# Altium schematic sheet 01. Cover.SchDoc
size A3
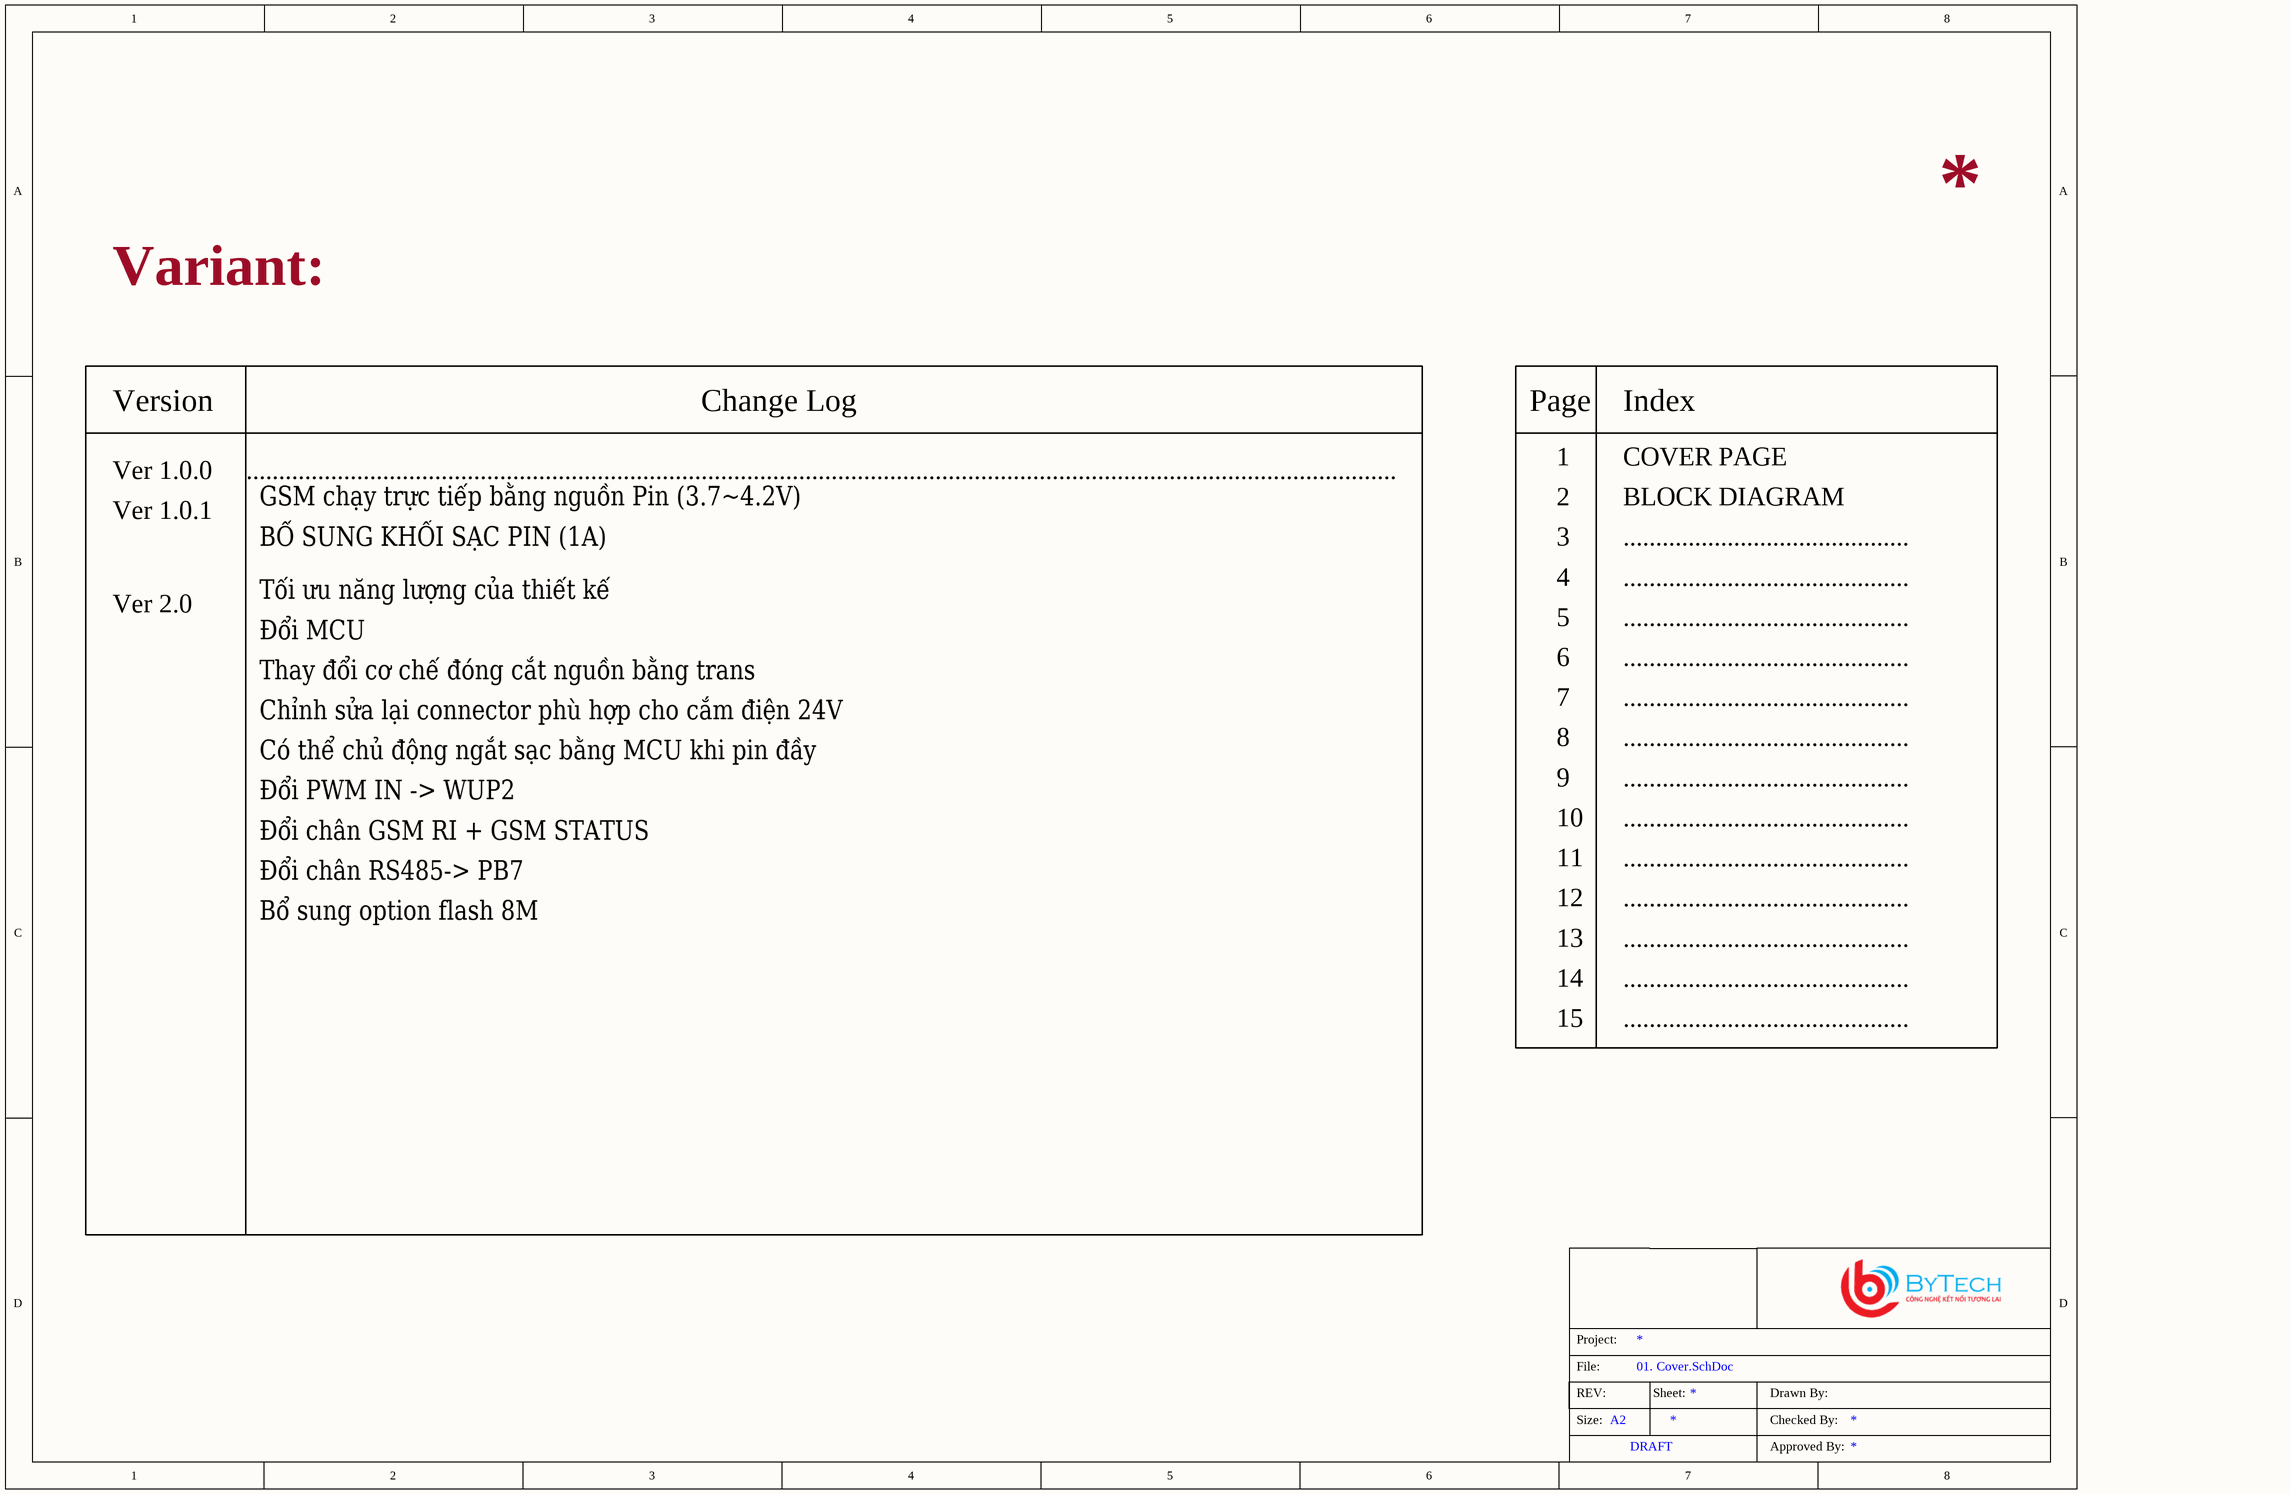
[diagram p0: 01. Cover.SchDoc]

## Notes on the sheet
- Variant:
- Version
- Change Log
- Page
- Index
- Ver 1.0.0
- .................................................................................................................................................................................
- GSM chạy trực tiếp bằng nguồn Pin (3.7~4.2V)
- 1
- 2
- COVER PAGE
- BLOCK DIAGRAM
- Ver 1.0.1
- BỔ SUNG KHỐI SẠC PIN (1A)
- 3
- ............................................
- Ver 2.0
- Tối ưu năng lượng của thiết kế
- Đổi MCU
- 4
- 5
- Thay đổi cơ chế đóng cắt nguồn bằng trans
- 6
- 7
- Chỉnh sửa lại connector phù hợp cho cắm điện 24V
- Có thể chủ động ngắt sạc bằng MCU khi pin đầy
- 8
- Đổi PWM IN -> WUP2
- Đổi chân GSM RI + GSM STATUS
- 9
- 10
- Đổi chân RS485-> PB7
- 11
- 12
- Bổ sung option flash 8M
- 13
- 14
- 15
- File:
- Project:
- REV:
- Size:
- A2
- Sheet:
- Drawn By:
- Checked By:
- DRAFT
- Approved By: